# EAGLE design Esquema (EAGLE 9.6.2)
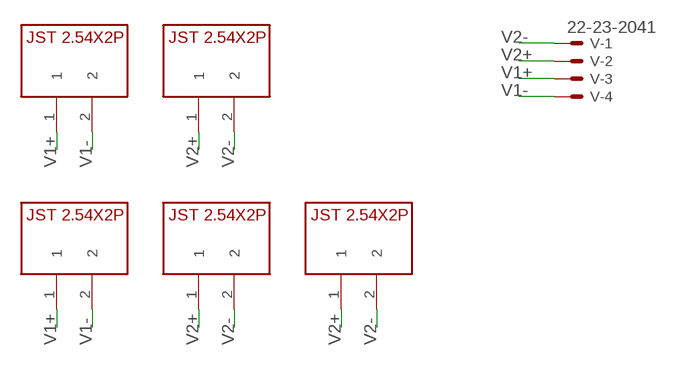
[diagram p0: schematic, sheet 1]

## Parts
U$1  JST2.54X2P  [JST2.54X2P_FOOTPRINT]
U$2  JST2.54X2P  [JST2.54X2P_FOOTPRINT]
U$3  JST2.54X2P  [JST2.54X2P_FOOTPRINT]
U$4  JST2.54X2P  [JST2.54X2P_FOOTPRINT]
U$5  JST2.54X2P  [JST2.54X2P_FOOTPRINT]
V  22-23-2041  [22-23-2041]

## Nets
V1+: U$1.1 U$4.1 V.3
V1-: U$1.2 U$4.2 V.4
V2+: U$2.1 U$3.1 U$5.1 V.2
V2-: U$2.2 U$3.2 U$5.2 V.1

## Library data of the parts
U$1-U$5 = CRD:JST2.54X2P: Conector JST 2 pinos (2.54mm de distância entre pinos)
V = con-molex:22-23-2041: .100" (2.54mm) Center Header - 4 Pin; MF: MOLEX; MPN: 22-23-2041; OC_FARNELL: 1462920; OC_NEWARK: 38C0355

## Board
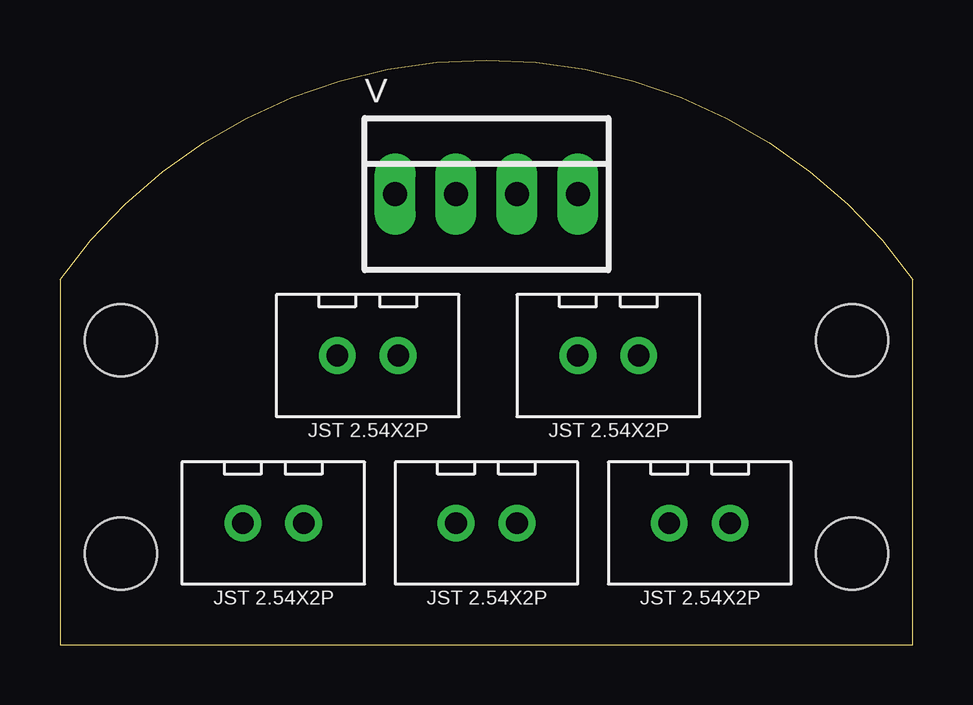
[diagram p1: board, top side]
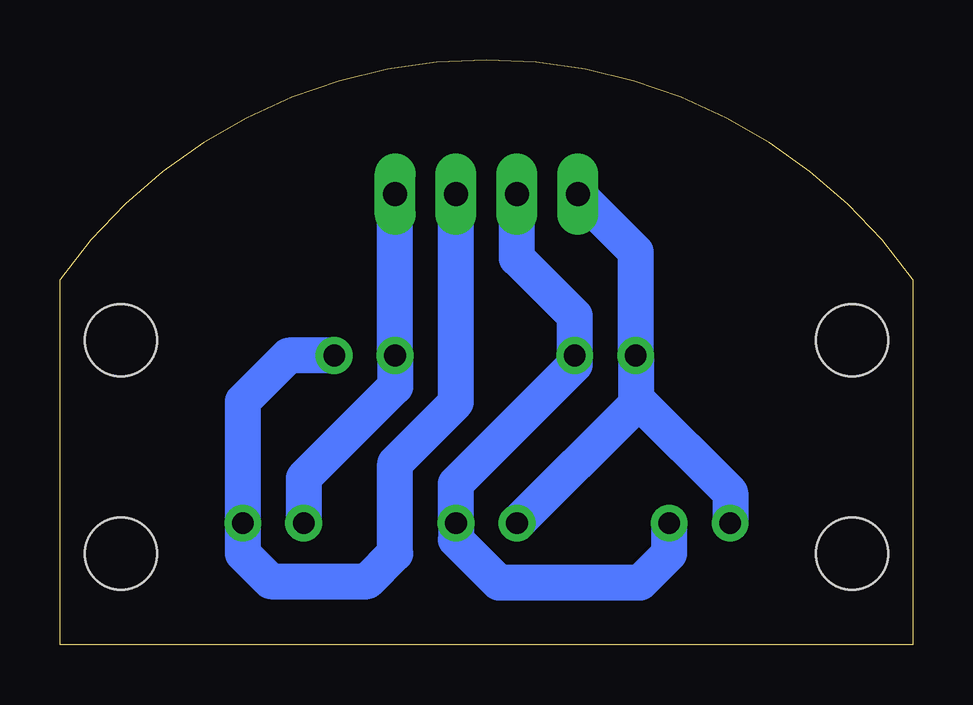
[diagram p2: board, bottom side, seen from below]

Size 35.56 x 24.39 mm. Coordinates in mm from the lower left corner, seen from the top.
Outline: 35.56,0 35.56,15.24 arc109 0,15.24 0,0 35.56,0
Copper layers (1*16): Top 0.035mm / dielectric 1.5mm / Bottom 0.035mm
Design rules "default": minimum track width 1.5mm, minimum drill 1mm, track to track 30mil, track to pad 20mil, pad to pad 6mil, via to via 6mil, smd to smd 6mil, copper to edge 40mil, drill to drill 6mil, minimum pad ring 10mil, minimum via ring 8mil, stop-mask expansion 4mil, vias tented up to drill 0mil, thermal gap 10mil
Holes 3 mm at 33.02,12.7 33.02,3.81 2.54,3.81 2.54,12.7

### Footprints (pad centres in the part's own frame; a part is rotated, then mirrored left to right if it is on the bottom)
JST2.54X2P_FOOTPRINT = drill 0.9: 1 -1.27,0; 2 1.27,0
22-23-2041 = drill 1 long: 1 -3.81,0; 2 -1.27,0; 3 1.27,0; 4 3.81,0

### Placement (x,y rotation side)
U$1  26.67,5.08 180 top
U$2  17.78,5.08 180 top
U$3  8.89,5.08 180 top
U$4  22.86,12.06 180 top
U$5  12.83,12.06 180 top
V  17.78,18.8 0 top

### Tracks (layer width: path | path; a pad name or v marks a point on that pad's centre or on a via)
V1+
  Bottom 1.5: U$4.1 26.04,12.06 27.94,10.16 U$1.1 27.94,3.81 26.79,2.65 22.75,2.65 21.59,3.81 21.59,7.57 19.05,10.11 V.3
V1-
  Bottom 1.5: U$1.2 25.4,6.96 21.59,10.77 U$4.2 V.4
V2+
  Bottom 1.5: U$3.1 10.16,3.81 11.37,2.6 17.27,2.6 19.05,4.38 U$2.1 19.05,6.73 14.1,11.68 U$5.1 14.1,13.72 16.51,16.13 V.2
V2-
  Bottom 1.5: 11.56,10.03 U$5.2 11.56,16.38 V.1 | U$2.2 11.56,10.03 | 11.56,10.03 11.43,10.16 7.62,6.35 U$3.2